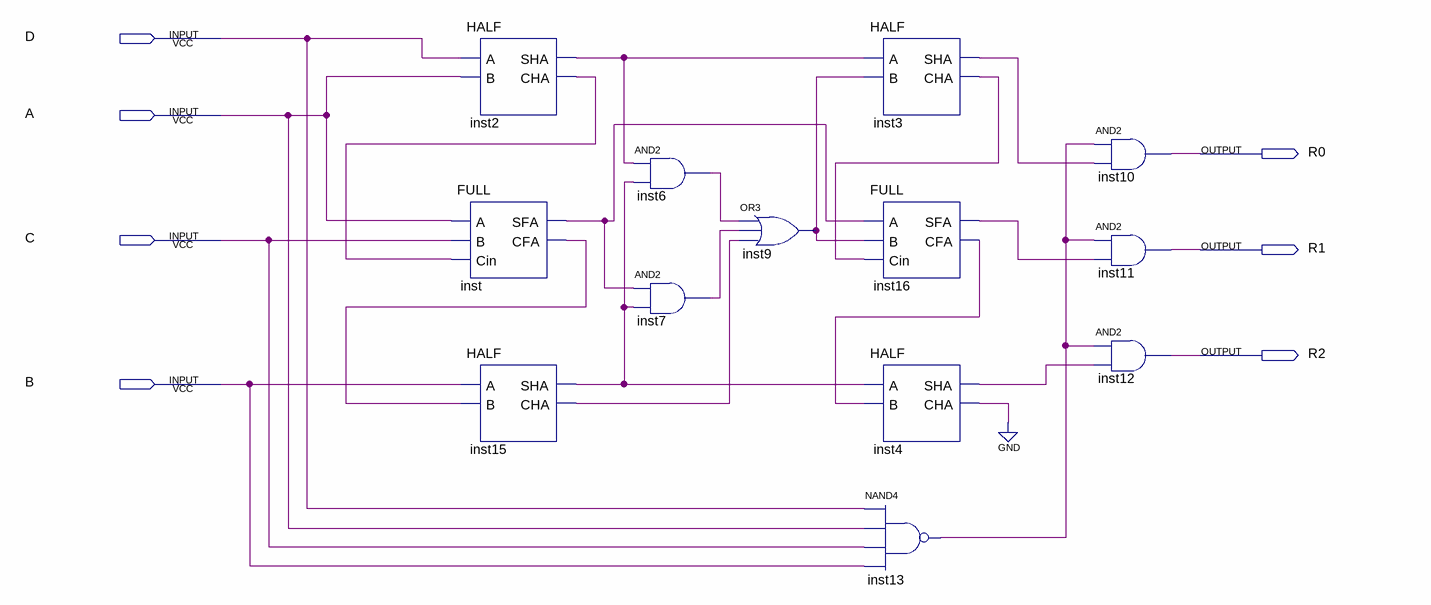
[diagram p0: schematic sheet]
// Quartus schematic MODD.bdf as structural Verilog: 13 symbols, 7 pins
module MODD (
  input  D,
  input  A,
  input  C,
  input  B,
  output R0,
  output R1,
  output R2
);

  wire inst2_cha, inst2_sha, inst3_cha, inst3_sha, inst4_cha, inst4_sha, inst6_out, inst7_out, inst9_out,
       inst13_out, inst15_cha, inst15_sha, inst16_cfa, inst16_sfa, inst_cfa, inst_sfa;

  HALF inst2 (.A(D), .B(A), .SHA(inst2_sha), .CHA(inst2_cha));
  FULL inst (.A(A), .B(C), .Cin(inst2_cha), .SFA(inst_sfa), .CFA(inst_cfa));
  HALF inst15 (.A(B), .B(inst_cfa), .SHA(inst15_sha), .CHA(inst15_cha));
  and inst6 (inst6_out, inst2_sha, inst15_sha);
  and inst7 (inst7_out, inst_sfa, inst15_sha);
  or inst9 (inst9_out, inst6_out, inst7_out, inst15_cha);
  HALF inst3 (.A(inst2_sha), .B(inst9_out), .SHA(inst3_sha), .CHA(inst3_cha));
  FULL inst16 (.A(inst_sfa), .B(inst9_out), .Cin(inst3_cha), .SFA(inst16_sfa), .CFA(inst16_cfa));
  HALF inst4 (.A(inst15_sha), .B(inst16_cfa), .SHA(inst4_sha), .CHA(inst4_cha));
  nand inst13 (inst13_out, D, A, C, B);
  and inst10 (R0, inst13_out, inst3_sha);
  and inst11 (R1, inst13_out, inst16_sfa);
  and inst12 (R2, inst13_out, inst4_sha);
  // also tied to GND on the sheet: inst4_cha
endmodule
